# EAGLE design Dash7Duino (EAGLE 6.4)
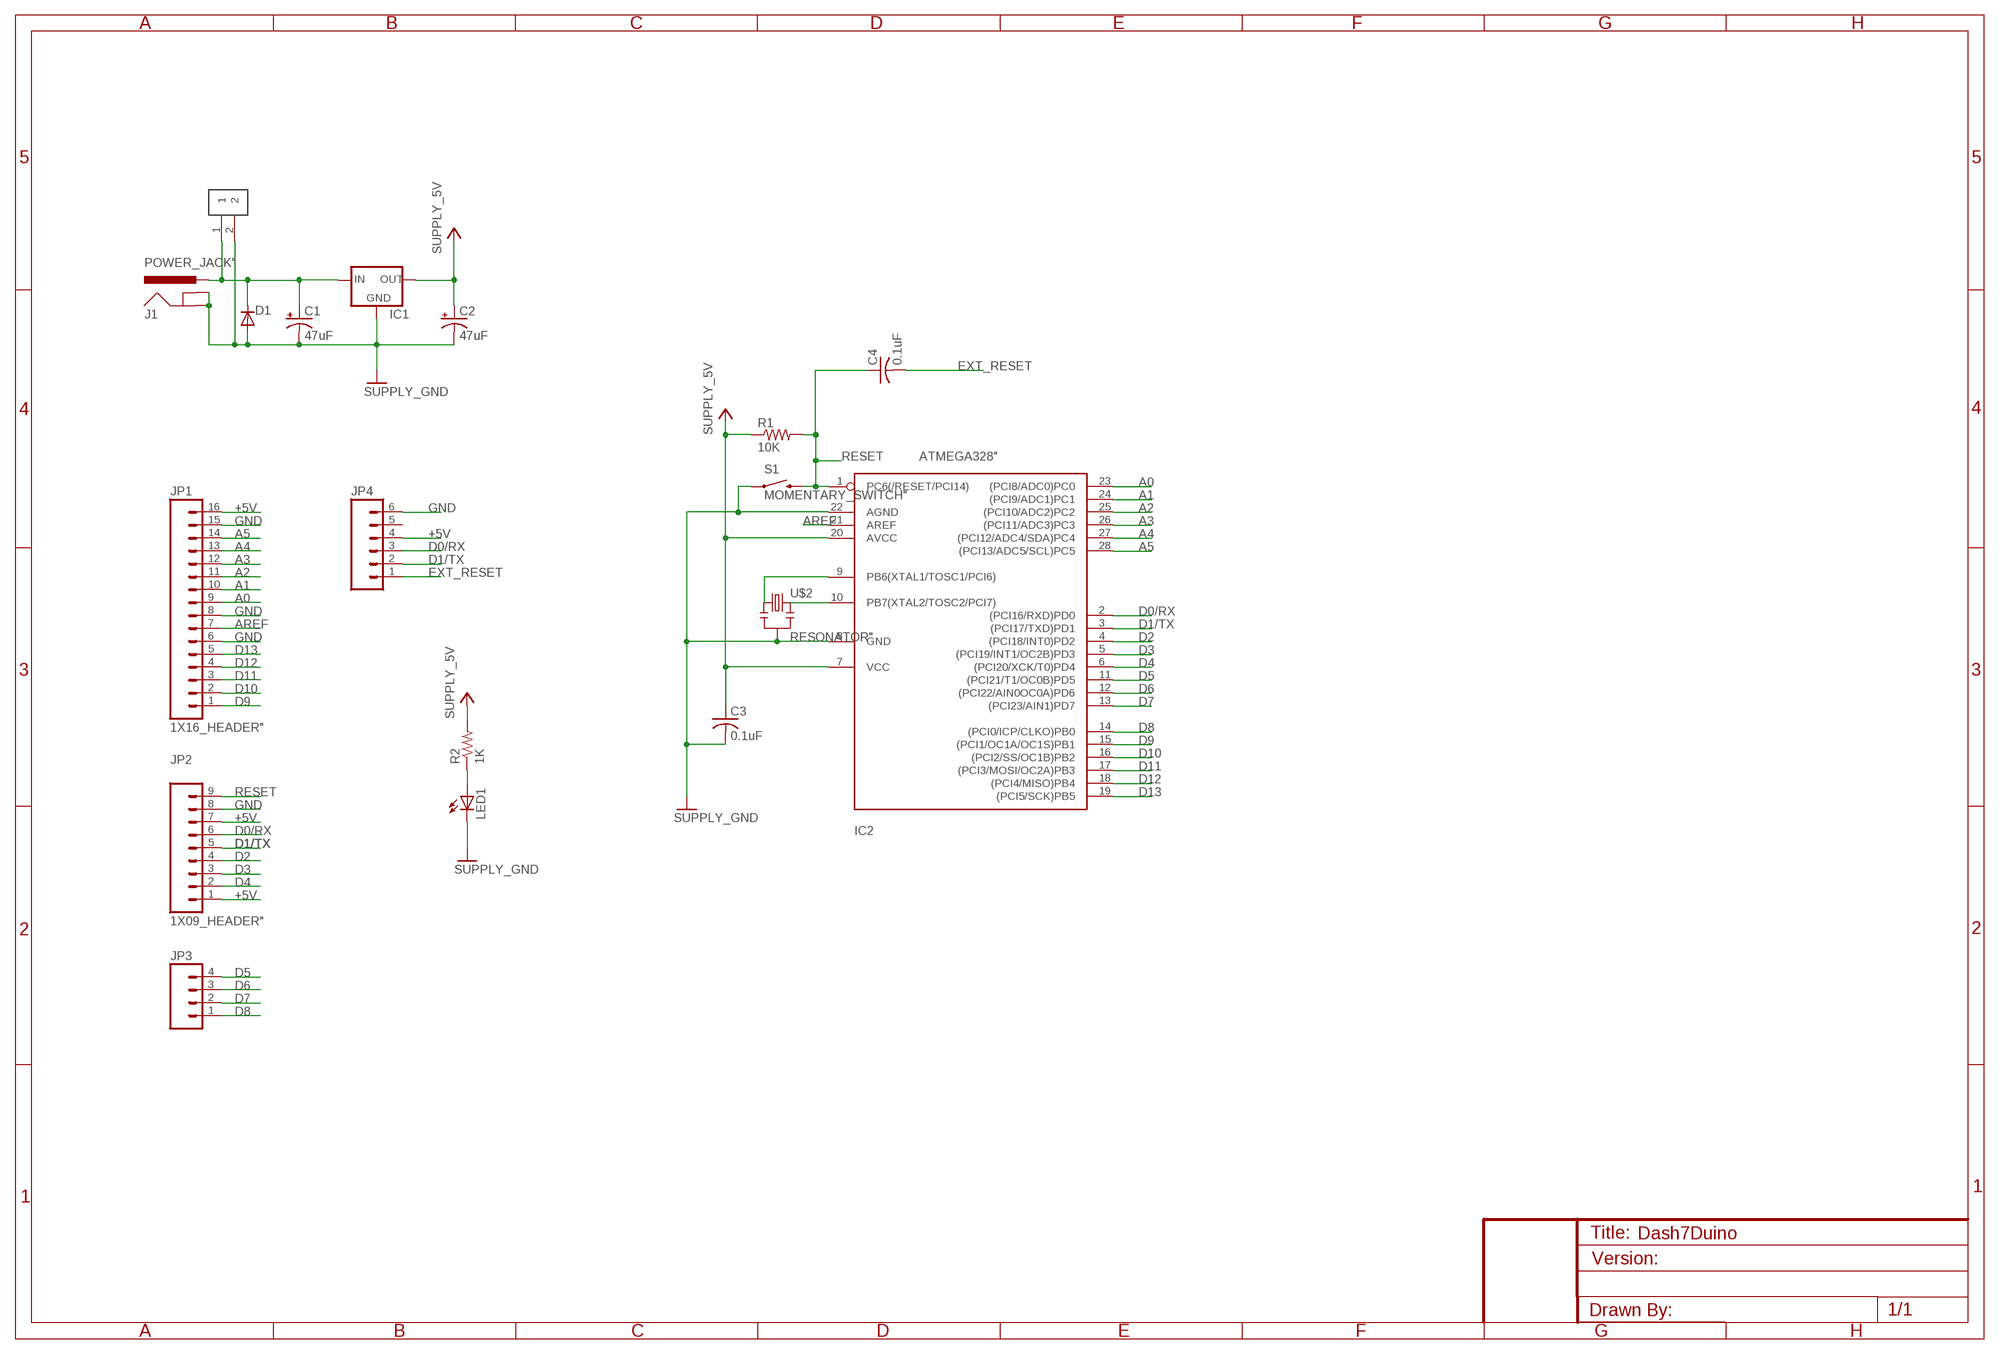
[diagram p0: schematic, sheet 1]

## Parts
C1  47uF  ELECTROLYTIC_CAP2.54MM  [ELECTROLYTIC_CAP]
C2  47uF  ELECTROLYTIC_CAP2.54MM  [ELECTROLYTIC_CAP]
C3  0.1uF  UNPOLARIZED_CAP"  [UNPOLARIZED_CAP]
C4  0.1uF  UNPOLARIZED_CAP"  [UNPOLARIZED_CAP]
D1  DIODE  [DIODE-1N4001-KIT]
IC1  REGULATOR  [L4931_REGULATOR]
IC2  ATMEGA328"  [ATMEGA328]
J1  POWER_JACK"  [POWER_JACK]
JP1  1X16_HEADER"  [1X16_HEADER]
JP2  1X09_HEADER"  [1X09_HEADER]
JP3  1X04_HEADER"  [1X04_HEADER]
JP4  1X06_HEADER"  [1X06_HEADER]
LED1  LED3MM  [LED]
R1  10K  RESISTOR1/6WATT  [RESISTOR]
R2  1K  RESISTOR1/6WATT  [RESISTOR]
S1  MOMENTARY_SWITCH"  [MOMENTARY_SWITCH]
U$1  1X02_HEADER  [1X02_HEADER]
U$2  RESONATOR"  [RESONATOR]

## Nets
5V: C1.+ D1.C IC1.IN J1.PWR U$1.1
+5V: C2.+ C3.1 IC1.OUT IC2.7(VCC) IC2.20(AVCC) JP1.16 JP2.1 JP2.7 JP4.4 R1.1 R2.2 ; supply symbol labelled SUPPLY_5V
A0: IC2.23((PCI8/ADC0)PC0) JP1.9
A1: IC2.24((PCI9/ADC1)PC1) JP1.10
A2: IC2.25((PCI10/ADC2)PC2) JP1.11
A3: IC2.26((PCI11/ADC3)PC3) JP1.12
A4: IC2.27((PCI12/ADC4/SDA)PC4) JP1.13
A5: IC2.28((PCI13/ADC5/SCL)PC5) JP1.14
AREF: IC2.21(AREF) JP1.7
D0/RX: IC2.2((PCI16/RXD)PD0) JP2.6 JP4.3
D1/TX: IC2.3((PCI17/TXD)PD1) JP2.5 JP4.2
D2: IC2.4((PCI18/INT0)PD2) JP2.4
D3: IC2.5((PCI19/INT1/OC2B)PD3) JP2.3
D4: IC2.6((PCI20/XCK/T0)PD4) JP2.2
D5: IC2.11((PCI21/T1/OC0B)PD5) JP3.4
D6: IC2.12((PCI22/AIN0OC0A)PD6) JP3.3
D7: IC2.13((PCI23/AIN1)PD7) JP3.2
D8: IC2.14((PCI0/ICP/CLKO)PB0) JP3.1
D9: IC2.15((PCI1/OC1A/OC1S)PB1) JP1.1
D10: IC2.16((PCI2/SS/OC1B)PB2) JP1.2
D11: IC2.17((PCI3/MOSI/OC2A)PB3) JP1.3
D12: IC2.18((PCI4/MISO)PB4) JP1.4
D13: IC2.19((PCI5/SCK)PB5) JP1.5
EXT_RESET: C4.2 JP4.1
GND: C1.- C2.- C3.2 D1.A IC1.GND IC2.8(GND) IC2.22(AGND) J1.GND J1.GNDBREAK JP1.6 JP1.8 JP1.15 JP2.8 JP4.6 LED1.K(C) S1.1 U$1.2 U$2.2 ; supply symbol labelled SUPPLY_GND
N$1: IC2.9(PB6(XTAL1/TOSC1/PCI6)) U$2.1
N$2: IC2.10(PB7(XTAL2/TOSC2/PCI7)) U$2.3
N$4: LED1.A R2.1
RESET: C4.1 IC2.1(PC6(/RESET/PCI14)) JP2.9 R1.2 S1.3
Unconnected: JP4.5

## Library data of the parts
C1 C2 = RBBB:ELECTROLYTIC_CAP: POLARIZED CAPACITOR, American symbol
C3 C4 = RBBB:UNPOLARIZED_CAP: CAPACITOR, American symbol
D1 = SparkFun-DiscreteSemi:DIODE: Diode These are standard reverse protection diodes and small signal diodes. SMA package can handle up to about 1A. SOD-323 can handle about 200mA. What the SOD-323 package when ordering, there are some mfgs out there that are 5-pin packages.
IC1 = RBBB:REGULATOR: VOLTAGE REGULATOR
IC2 = RBBB:ATMEGA328: MICROCONTROLLER 16 kBytes FLASH 1 kBytes SRAM 512 Bytes EEPROM USART 8-channel 10 bit ADC
J1 = RBBB:POWER_JACK: Power Jack This is the standard 5.5mm barrel jack for power. The PTH is the most common, proven, reliable, footprint. All others are experimental. The Slot footprint only works if the mill layer is transmitted to the PCB fab house so be warned. Spark Fun Electronics SKU : PRT-00119. Mating wall wart : TOL-00298 (and others)
JP1 = RBBB:1X16_HEADER
JP2 = RBBB:1X09_HEADER: Header 9 Standard 9-pin 0.1" header. Use with straight break away headers (SKU : PRT-00116), right angle break away headers (PRT-00553), swiss pins (PRT-00743), machine pins (PRT-00117), and female headers (PRT-00115).
JP3 = RBBB:1X04_HEADER: Header 4 Standard 4-pin 0.1" header. Use with straight break away headers (SKU : PRT-00116), right angle break away headers (PRT-00553), swiss pins (PRT-00743), machine pins (PRT-00117), and female headers (PRT-00115). Molex polarized connector foot print use with SKU : PRT-08231 with associated crimp pins and housings.
JP4 = RBBB:1X06_HEADER
LED1 = RBBB:LED: LED OSRAM: - CHIPLED LG R971, LG N971, LY N971, LG Q971, LY Q971, LO R971, LY R971 LH N974, LH R974 LS Q976, LO Q976, LY Q976 LO Q996 - Hyper CHIPLED LW Q18S LB Q993, LB Q99A, LB R99A - SideLED LS A670, LO A670, LY A670, LG A670, LP A670 LB A673, LV A673, LT A673, LW A673 LH A674 LY A675 LS A676, LA A676, LO A676, LY A676, LW A676 LS A679, LY A679, LG A679 - Hyper Micro SIDELED® LS Y876, LA Y876, LO Y876, LY Y876 LT Y87S - SmartLED LW L88C, LW L88S LB L89C, LB L89S, LG L890 LS L89K, LO L89K, LY L89K LS L896, LA L896, LO L896, LY L896 - TOPLED LS T670, LO T670, LY T670, LG T670, LP T670 LSG T670, LSP T670, LSY T670, LOP T670, LYG T670 LG T671, LOG T671, LSG T671 LB T673, LV T673, LT T673, LW T673 LH T674 LS T676, LA T676, LO T676, LY T676, LB T676, LH T676, LSB T676, LW T676 LB T67C, LV T67C, LT T67C, LS T67K, LO T67K, LY T67K, LW E67C LS E67B, LA E67B, LO E67B, LY E67B, LB E67C, LV E67C, LT E67C LW T67C LS T679, LY T679, LG T679 LS T770, LO T770, LY T770, LG T770, LP T770 LB T773, LV T773, LT T773, LW T773 LH T774 LS E675, LA E675, LY E675, LS T675 LS T776, LA T776, LO T776, LY T776, LB T776 LHGB T686 LT T68C, LB T68C - Hyper Mini TOPLED® LB M676 - Mini TOPLED Santana® LG M470 LS M47K, LO M47K, LY M47K Source: http://www.osram.convergy.de LUXEON: - LUMILED® LXK2-PW12-R00, LXK2-PW12-S00, LXK2-PW14-U00, LXK2-PW14-V00 LXK2-PM12-R00, LXK2-PM12-S00, LXK2-PM14-U00 LXK2-PE12-Q00, LXK2-PE12-R00, LXK2-PE12-S00, LXK2-PE14-T00, LXK2-PE14-U00 LXK2-PB12-K00, LXK2-PB12-L00, LXK2-PB12-M00, LXK2-PB14-N00, LXK2-PB14-P00, LXK2-PB14-Q00 LXK2-PR12-L00, LXK2-PR12-M00, LXK2-PR14-Q00, LXK2-PR14-R00 LXK2-PD12-Q00, LXK2-PD12-R00, LXK2-PD12-S00 LXK2-PH12-R00, LXK2-PH12-S00 LXK2-PL12-P00, LXK2-PL12-Q00, LXK2-PL12-R00 Source: www.luxeon.com KINGBRIGHT: KA-3528ASYC Source: www.kingbright.com
R1 R2 = RBBB:RESISTOR: RESISTOR, American symbol
S1 = RBBB:MOMENTARY_SWITCH
U$1 = RBBB:1X02_HEADER
U$2 = RBBB:RESONATOR: Resonator Small SMD resonator. This is the itty bitty 10/20MHz resonators with built in caps. CSTCE10M0G55 and CSTCE20M0V53. Footprint has been reviewed closely but hasn t been tested yet.'

## Board
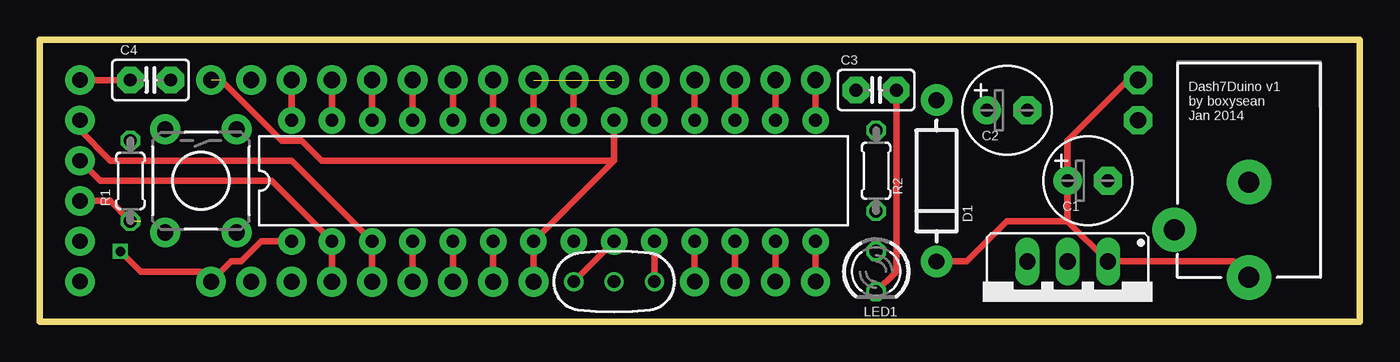
[diagram p1: board, top side]
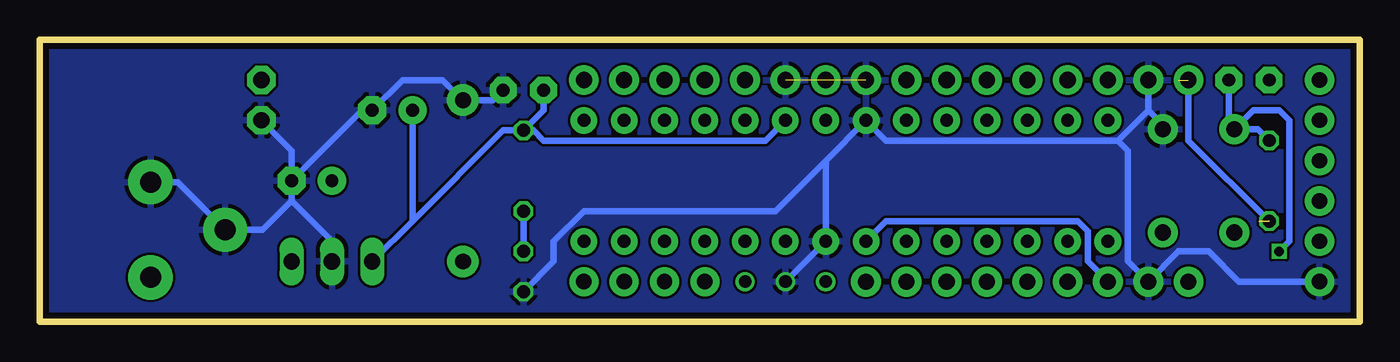
[diagram p2: board, bottom side, seen from below]

Size 83.19 x 17.78 mm. Coordinates in mm from the lower left corner, seen from the top.
Outline: 0,17.78 0,0 83.19,0 83.19,17.78 0,17.78
Copper layers (1*16): Top 0.0356mm / dielectric 1.5011mm / Bottom 0.0356mm
Design rules "LaenPCBOrder": minimum track width 6mil, minimum drill 13mil, track to track 6mil, track to pad 6mil, pad to pad 6mil, via to via 6mil, smd to smd 6mil, copper to edge 15mil, drill to drill 6mil, minimum pad ring 7mil, minimum via ring 7mil, stop-mask expansion 3mil, vias tented up to drill 0mil, thermal gap 10mil

### Footprints (pad centres in the part's own frame; a part is rotated, then mirrored left to right if it is on the bottom)
ELECTROLYTIC_CAP = drill 0.813 pad 1.778: + -1.27,0 | drill 0.813 pad 1.778 octagon: - 1.27,0
UNPOLARIZED_CAP = drill 0.813 pad 1.676 octagon: 1 -1.27,0; 2 1.27,0
DIODE-1N4001-KIT = drill 1 pad 1.981: A -5.08,0; C 5.08,0
L4931_REGULATOR = drill 1.016 long: GND 0,-2.54; IN -2.54,-2.54; OUT 2.54,-2.54
ATMEGA328 = drill 0.813 pad 1.676: 1 -16.51,-3.81; 2 -13.97,-3.81; 3 -11.43,-3.81; 4 -8.89,-3.81; 5 -6.35,-3.81; 6 -3.81,-3.81; 7 -1.27,-3.81; 8 1.27,-3.81; 9 3.81,-3.81; 10 6.35,-3.81; 11 8.89,-3.81; 12 11.43,-3.81; 13 13.97,-3.81; 14 16.51,-3.81; 15 16.51,3.81; 16 13.97,3.81; 17 11.43,3.81; 18 8.89,3.81; 19 6.35,3.81; 20 3.81,3.81; 21 1.27,3.81; 22 -1.27,3.81; 23 -3.81,3.81; 24 -6.35,3.81; 25 -8.89,3.81; 26 -11.43,3.81; 27 -13.97,3.81; 28 -16.51,3.81
POWER_JACK = drill 1.321 pad 2.794: GND 0,7.7; GNDBREAK 4.7,10.7; PWR 0,13.7
1X16_HEADER = drill 1.016 pad 1.88: 1 0,0; 2 2.54,0; 3 5.08,0; 4 7.62,0; 5 10.16,0; 6 12.7,0; 7 15.24,0; 8 17.78,0; 9 20.32,0; 10 22.86,0; 11 25.4,0; 12 27.94,0; 13 30.48,0; 14 33.02,0; 15 35.56,0; 16 38.1,0
1X09_HEADER = drill 1.016 pad 1.88: 1 0,0; 2 2.54,0; 3 5.08,0; 4 7.62,0; 5 10.16,0; 6 12.7,0; 7 15.24,0; 8 17.78,0; 9 20.32,0
1X04_HEADER = drill 0.965 pad 1.829: 1 0,0; 2 2.54,0; 3 5.08,0; 4 7.62,0
1X06_HEADER = drill 0.965 pad 1.829: 1 0,0; 2 2.54,0; 3 5.08,0; 4 7.62,0; 5 10.16,0; 6 12.7,0
LED = drill 0.813 octagon: A -1.27,0; K 1.27,0
RESISTOR = drill 0.813 octagon: 1 -2.54,0; 2 2.54,0
MOMENTARY_SWITCH = drill 1.016 pad 1.88: 1 -3.251,2.261; 2 3.251,2.261; 3 -3.251,-2.261; 4 3.251,-2.261
1X02_HEADER = drill 1.016 pad 1.778 octagon: 1 -1.27,0; 2 1.27,0
RESONATOR = drill 0.8: 1 -2.54,0; 2 0,0; 3 2.54,0

### Placement (x,y rotation side)
C1  66.04,8.89 0 top
C2  60.96,13.34 0 top
C3  52.7,14.61 0 top
C4  6.99,15.24 180 top
D1  56.52,8.89 270 top
IC1  64.77,1.27 180 top
IC2  32.38,8.89 0 top
J1  76.2,16.51 180 top
JP1  48.9,15.24 180 top
JP2  31.11,2.54 180 top
JP3  48.9,2.54 180 top
JP4  2.54,15.24 270 top
LED1  52.7,3.17 270 top
R1  5.71,8.89 90 top
R2  52.7,9.53 90 top
S1  10.16,8.89 270 top
U$1  69.22,13.97 270 top
U$2  36.2,2.54 0 top

### Tracks (layer width: path | path; a pad name or v marks a point on that pad's centre or on a via)
5V
  Top 0.406: U$1.1 68.58,15.24 64.77,11.43 C1.+ 64.77,6.35 | 64.77,6.35 IC1.IN 75.2,3.81 J1.PWR | D1.C 58.42,3.81 60.96,6.35 64.77,6.35
+5V  (3 unrouted)
  Top 0.406: JP2.1 IC2.7 36.2,10.16 | 36.2,10.16 IC2.20 | 36.2,10.16 17.78,10.16 16.51,11.43 15.24,11.43 11.43,15.24 JP1.16 | JP4.4 4.45,7.62 R1.1
  Bottom 0.406: C2.+ 59.69,6.35 | 59.69,6.35 IC1.OUT | R2.2 53.98,12.06 59.69,6.35 | C3.1 51.44,13.34 R2.2 | JP2.7 17.14,3.81 17.14,5.71 17.78,6.35 29.84,6.35 IC2.7 | IC2.20 37.47,11.43 51.44,11.43 52.07,12.06 R2.2 | R1.1 10.79,11.43 JP1.16
A0
  Top 0.406: IC2.23 JP1.9
A1
  Top 0.406: IC2.24 JP1.10
A2
  Top 0.406: IC2.25 JP1.11
A3
  Top 0.406: IC2.26 JP1.12
A4
  Top 0.406: IC2.27 JP1.13
A5
  Top 0.406: IC2.28 JP1.14
AREF
  Top 0.406: IC2.21 JP1.7
D0/RX
  Top 0.406: JP2.6 IC2.2 14.61,8.89 3.81,8.89 JP4.3
D1/TX
  Top 0.406: JP2.5 IC2.3 15.88,10.16 4.45,10.16 2.54,12.06 JP4.2
D2
  Top 0.406: IC2.4 JP2.4
D3
  Top 0.406: IC2.5 JP2.3
D4
  Top 0.406: JP2.2 IC2.6
D5
  Top 0.406: IC2.11 JP3.4
D6
  Top 0.406: IC2.12 JP3.3
D7
  Top 0.406: IC2.13 JP3.2
D8
  Top 0.406: IC2.14 JP3.1
D9
  Top 0.406: JP1.1 IC2.15
D10
  Top 0.406: JP1.2 IC2.16
D11
  Top 0.406: JP1.3 IC2.17
D12
  Top 0.406: IC2.18 JP1.4
D13
  Top 0.406: JP1.5 IC2.19
EXT_RESET
  Top 0.406: JP4.1 C4.2
GND  (1 unrouted)
  Top 0.406: LED1.K 53.98,3.17 C3.2 | IC2.22 JP1.8
  Bottom 0.406: C1.- 62.87,13.34 C2.- 60.33,15.24 57.78,15.24 D1.A 54.61,13.97 C3.2 | C1.- 67.31,7.62 | 67.31,7.62 64.77,5.08 IC1.GND | U$2.2 IC2.8 33.66,10.16 | 33.66,10.16 IC2.22 29.84,11.43 15.24,11.43 | LED1.K 50.8,3.81 50.8,5.08 48.9,6.99 36.83,6.99 33.66,10.16 | JP1.15 13.34,13.34 | 13.34,13.34 15.24,11.43 | S1.1 12.42,12.42 13.34,13.34 | 15.24,11.43 14.61,10.79 14.61,3.81 JP2.8 11.43,4.45 9.53,4.45 7.62,2.54 JP4.6 | J1.GND 74.5,8.81 J1.GNDBREAK 69.12,5.81 67.31,7.62 | C1.- 67.31,10.79 U$1.2
  pour Bottom: 0,17.78 0,0 83.19,0 83.19,17.78
N$1
  Top 0.406: IC2.9 U$2.1
N$2
  Top 0.406: IC2.10 U$2.3
N$4
  Bottom 0.406: LED1.A R2.1
RESET  (via drill 0.6)
  Top 0.406: IC2.1 13.97,5.08 12.7,3.81 12.06,3.81 JP2.9 10.16,3.17 6.35,3.17 v5.08,4.45
  Bottom 0.406: C4.1 8.26,12.5 S1.3 | S1.3 6.71,13.34 5.08,13.34 4.45,12.7 4.45,5.08 v5.08,4.45 | R1.2 6.43,12.14 S1.3

### Text on the board
tPlace: Dash7Duino v1 / by boxysean / Jan 2014